# Altium schematic sheet RAMP V1-4交流電.SCHDOC
size 381 x 241 mm
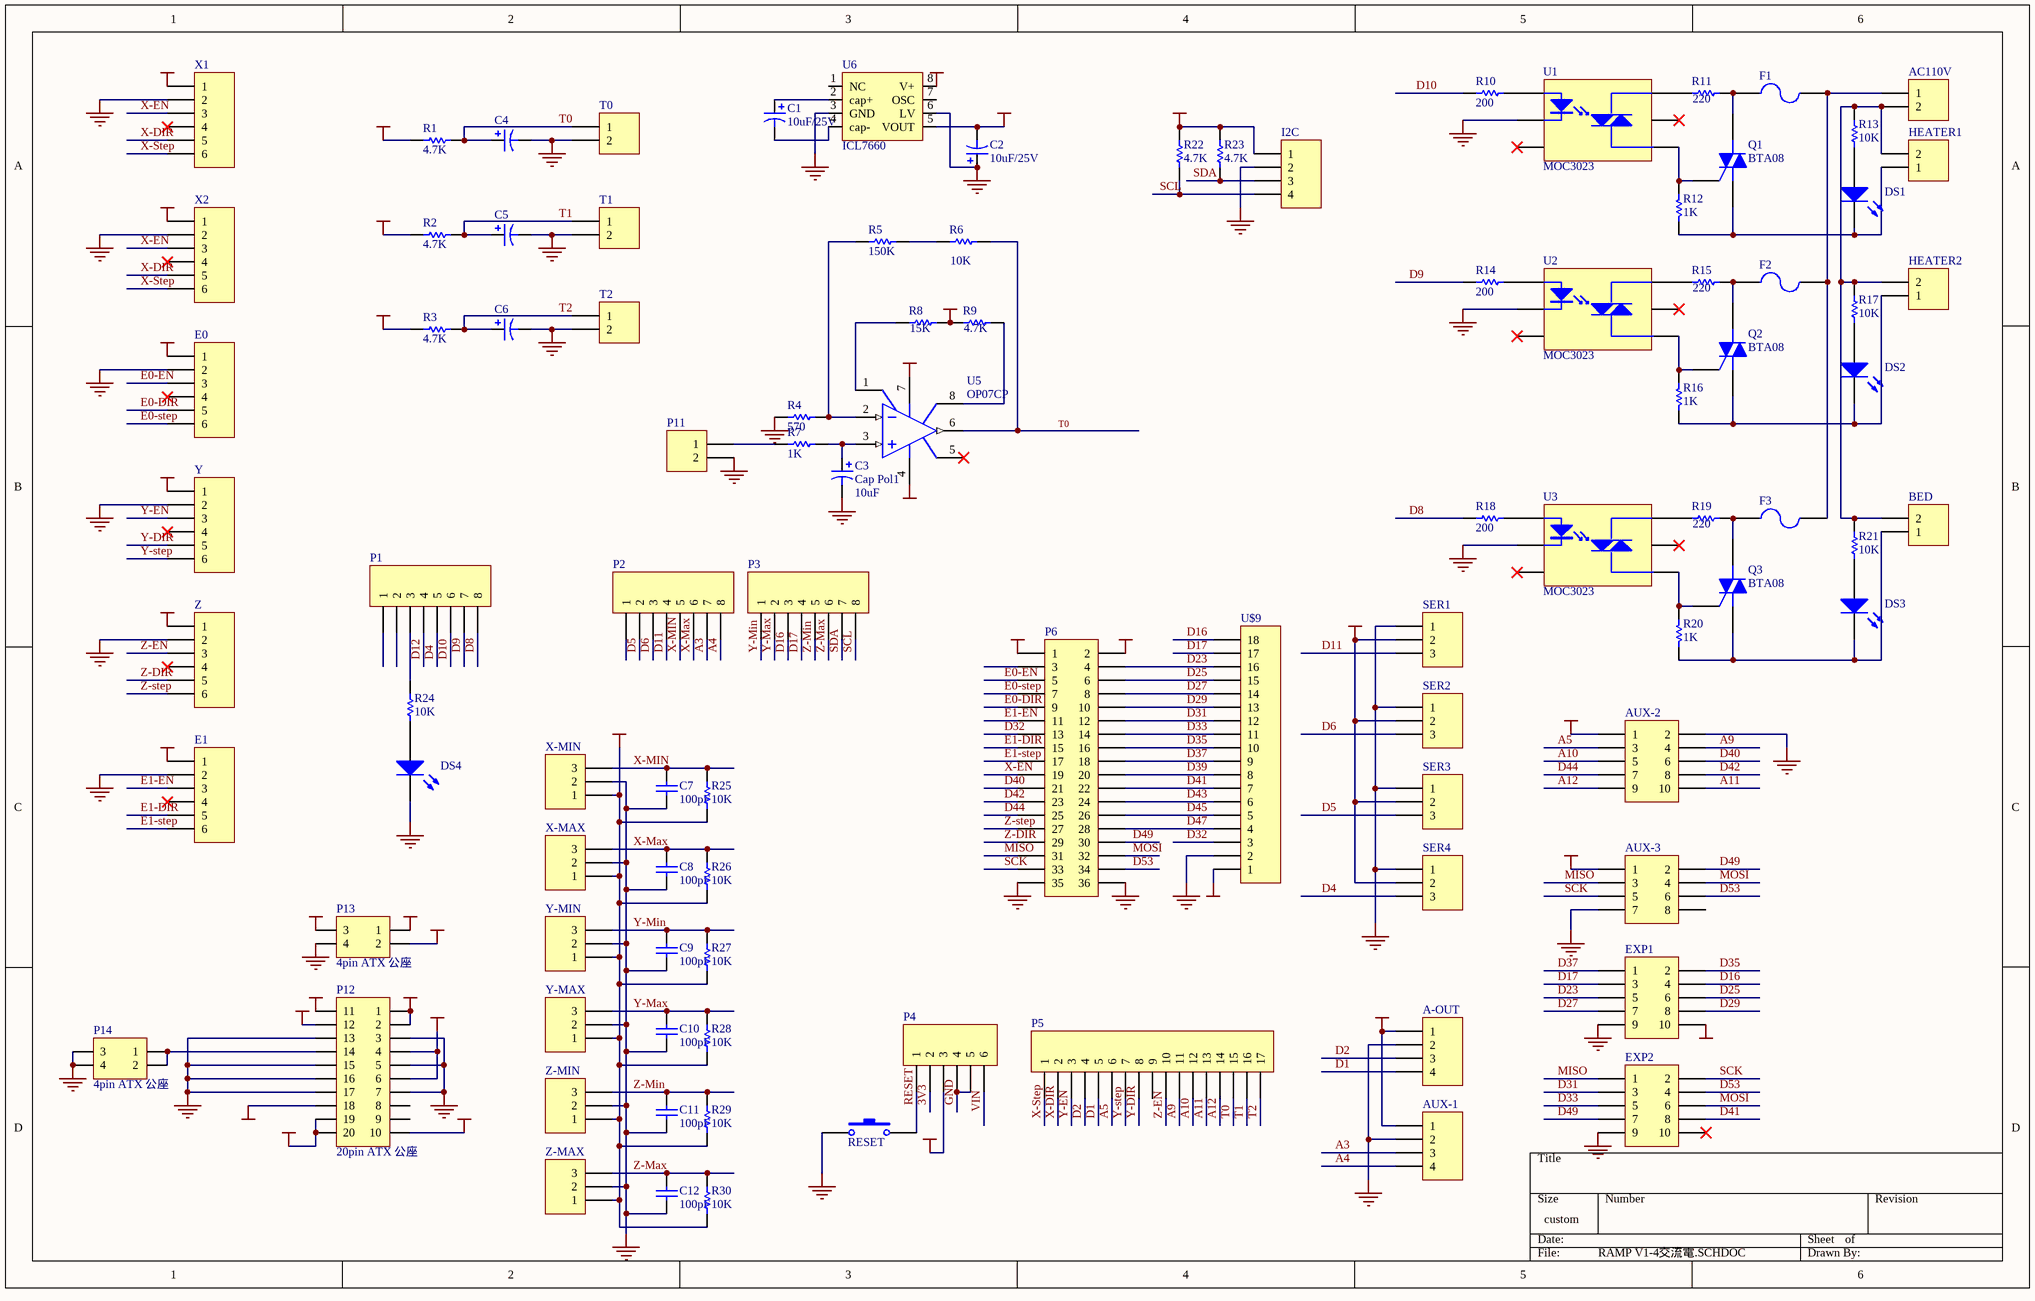
[diagram p0: RAMP V1-4交流電.SCHDOC]

## Parts
A-OUT  Header 4  [HDR1X4]  (value not drawn)
AC110V  Header 2  [2PIN端子-1]  (value not drawn)
AUX-1  Header 4  [HDR1X4]  (value not drawn)
AUX-2  Header 5X2  [HDR2X5]  (value not drawn)
AUX-3  Header 4X2  [HDR2X4]  (value not drawn)
BED  Header 2  [2PIN端子-1]  (value not drawn)
C1  value 10uF/25V  [CAPPR5-5x5]  (hidden comment: Cap Pol1)
C2  value 10uF/25V  [CAPPR5-5x5]  (hidden comment: Cap Pol1)
C3  Cap Pol1  value 10uF  [CAPPR5-5x5]
C4  Cap Pol1  [CAPPR2-5x6.8]  (value not drawn)
C5  Cap Pol1  [CAPPR2-5x6.8]  (value not drawn)
C6  Cap Pol1  [CAPPR2-5x6.8]  (value not drawn)
C7  value 100pF  [CAPR2.54-5.1x3.2]  (hidden comment: Cap)
C8  value 100pF  [CAPR2.54-5.1x3.2]  (hidden comment: Cap)
C9  value 100pF  [CAPR2.54-5.1x3.2]  (hidden comment: Cap)
C10  value 100pF  [CAPR2.54-5.1x3.2]  (hidden comment: Cap)
C11  value 100pF  [CAPR2.54-5.1x3.2]  (hidden comment: Cap)
C12  value 100pF  [CAPR2.54-5.1x3.2]  (hidden comment: Cap)
DS1  LED0  [LED-2]  (value not drawn)
DS2  LED0  [LED-2]  (value not drawn)
DS3  LED0  [LED-2]  (value not drawn)
DS4  LED0  [LED-2]  (value not drawn)
E0  Header 6  [2.54mm 6pin]  (value not drawn)
E1  Header 6  [2.54mm 6pin]  (value not drawn)
EXP1  Header 5X2  [10pin牛角公座]  (value not drawn)
EXP2  Header 5X2  [10pin牛角公座]  (value not drawn)
F1  Fuse 2  [保險絲座]  (value not drawn)
F2  Fuse 2  [保險絲座]  (value not drawn)
F3  Fuse 2  [保險絲座]  (value not drawn)
HEATER1  Header 2  [2PIN端子-1]  (value not drawn)
HEATER2  Header 2  [2PIN端子-1]  (value not drawn)
I2C  Header 4  [HDR1X4]  (value not drawn)
P1  Header 8  [HDR1X8]  (value not drawn)
P2  Header 8  [HDR1X8]  (value not drawn)
P3  Header 8  [HDR1X8]  (value not drawn)
P4  Header 6  [HDR1X6]  (value not drawn)
P5  Header 17  [HDR1X17]  (value not drawn)
P6  Header 18X2  [HDR2X18]  (value not drawn)
P11  Header 2  [2PIN端子¥x¦³¦Õ]  (value not drawn)
P12  20pin ATX 公座  [4.2mm 20pin]
P13  4pin ATX 公座  [4.2mm 4pin]
P14  4pin ATX 公座  [4.2mm 4pin]
Q1  BTA08  [SFM-T3/X1.6V]
Q2  BTA08  [SFM-T3/X1.6V]
Q3  BTA08  [SFM-T3/X1.6V]
R1  value 4.7K  [AXIAL-0.3]  (hidden comment: Res1)
R2  value 4.7K  [AXIAL-0.3]  (hidden comment: Res1)
R3  value 4.7K  [AXIAL-0.3]  (hidden comment: Res1)
R4  value 570  [AXIAL-0.3]  (hidden comment: Res1)
R5  value 150K  [AXIAL-0.3]  (hidden comment: Res1)
R6  value 10K  [AXIAL-0.3]  (hidden comment: Res1)
R7  value 1K  [AXIAL-0.3]  (hidden comment: Res1)
R8  value 15K  [AXIAL-0.3]  (hidden comment: Res1)
R9  value 4.7K  [AXIAL-0.3]  (hidden comment: Res1)
R10  value 200  [AXIAL-0.4]  (hidden comment: Res1)
R11  value 220  [AXIAL-0.7]  (hidden comment: Res1)
R12  value 1K  [AXIAL-0.6]  (hidden comment: Res1)
R13  value 10K  [AXIAL-0.3]  (hidden comment: Res1)
R14  value 200  [AXIAL-0.4]  (hidden comment: Res1)
R15  value 220  [AXIAL-0.7]  (hidden comment: Res1)
R16  value 1K  [AXIAL-0.6]  (hidden comment: Res1)
R17  value 10K  [AXIAL-0.3]  (hidden comment: Res1)
R18  value 200  [AXIAL-0.4]  (hidden comment: Res1)
R19  value 220  [AXIAL-0.7]  (hidden comment: Res1)
R20  value 1K  [AXIAL-0.6]  (hidden comment: Res1)
R21  value 10K  [AXIAL-0.3]  (hidden comment: Res1)
R22  value 4.7K  [AXIAL-0.3]  (hidden comment: Res1)
R23  value 4.7K  [AXIAL-0.3]  (hidden comment: Res1)
R24  value 10K  [AXIAL-0.3]  (hidden comment: Res1)
R25  value 10K  [AXIAL-0.3]  (hidden comment: Res1)
R26  value 10K  [AXIAL-0.3]  (hidden comment: Res1)
R27  value 10K  [AXIAL-0.3]  (hidden comment: Res1)
R28  value 10K  [AXIAL-0.3]  (hidden comment: Res1)
R29  value 10K  [AXIAL-0.3]  (hidden comment: Res1)
R30  value 10K  [AXIAL-0.3]  (hidden comment: Res1)
RESET  SW-PB  [SW DIP4-2]  (value not drawn)
SER1  Header 3  [HDR1X3]  (value not drawn)
SER2  Header 3  [HDR1X3]  (value not drawn)
SER3  Header 3  [HDR1X3]  (value not drawn)
SER4  Header 3  [HDR1X3]  (value not drawn)
T0  Header 2  [HDR1X2]  (value not drawn)
T1  Header 2  [HDR1X2]  (value not drawn)
T2  Header 2  [HDR1X2]  (value not drawn)
U1  MOC3023  [DIP-6]
U2  MOC3023  [DIP-6]
U3  MOC3023  [DIP-6]
U5  OP07CP  [DIP-8]
U6  ICL7660  [DIP-8]
U$9  Header 18  [HDR1X18]  (value not drawn)
X1  Header 6  [2.54mm 6pin]  (value not drawn)
X2  Header 6  [2.54mm 6pin]  (value not drawn)
X-MAX  Header 3  [2.54mm 3pin]  (value not drawn)
X-MIN  Header 3  [2.54mm 3pin]  (value not drawn)
Y  Header 6  [2.54mm 6pin]  (value not drawn)
Y-MAX  Header 3  [2.54mm 3pin]  (value not drawn)
Y-MIN  Header 3  [2.54mm 3pin]  (value not drawn)
Z  Header 6  [2.54mm 6pin]  (value not drawn)
Z-MAX  Header 3  [2.54mm 3pin]  (value not drawn)
Z-MIN  Header 3  [2.54mm 3pin]  (value not drawn)

## Nets
+3-3: P12.1 P12.2 P12.11 P13.2
+5: A-OUT.1 AUX-1.1 AUX-2.1 AUX-3.1 E0.1 E1.1 EXP1.10 I2C.1 P4.3 P6.1 P6.2 P12.4 P12.6 P12.19 P12.20 R1.1 R2.1 R3.1 R8.2 R9.1 R22.2 R23.2 R25.1 R26.1 R27.1 R28.1 R29.1 R30.1 SER1.2 SER2.2 SER3.2 SER4.2 U5.7(V+) U6.8(V+) U$9.1 X1.1 X2.1 X-MAX.1 X-MIN.1 Y.1 Y-MAX.1 Y-MIN.1 Z.1 Z-MAX.1 Z-MIN.1
+12: P12.10 P13.1
-5: C2.2 P12.18 U5.4(V-) U6.5(VOUT)
-12: P12.12
GND: A-OUT.2 AUX-1.2 AUX-2.2 AUX-3.7 C2.1 C3.2 C4.2 C5.2 C6.2 C7.1 C8.1 C9.1 C10.1 C11.1 C12.1 DS4.2(K) E0.2 E1.2 EXP1.9 EXP2.9 I2C.2 P4.4 P4.5 P6.35 P6.36 P11.2 P12.3 P12.5 P12.7 P12.13 P12.15 P12.16 P12.17 P13.4 P14.3 P14.4 R4.1 RESET.2 SER1.1 SER2.1 SER3.1 SER4.1 T0.2 T1.2 T2.2 U1.2(C) U2.2(C) U3.2(C) U6.3(GND) U6.6(LV) U$9.2 X1.2 X2.2 X-MAX.2 X-MIN.2 Y.2 Y-MAX.2 Y-MIN.2 Z.2 Z-MAX.2 Z-MIN.2
VCC: P13.3
3V3: P4.2
A3: AUX-1.3 P2.7
A4: AUX-1.4 P2.8
A5: AUX-2.3 P5.6
A9: AUX-2.4 P5.11
A10: AUX-2.5 P5.12
A11: AUX-2.10 P5.13
A12: AUX-2.9 P5.14
D1: A-OUT.4 P5.5
D2: A-OUT.3 P5.4
D4: P1.5 SER4.3
D5: P2.2 SER3.3
D6: P2.3 SER2.3
D8: P1.8 R18.1
D9: P1.7 R14.1
D10: P1.6 R10.1
D11: P2.4 SER1.3
D12: P1.4
D16: EXP1.4 P3.3 U$9.18
D17: EXP1.3 P3.4 U$9.17
D23: EXP1.5 P6.4 U$9.16
D25: EXP1.6 P6.6 U$9.15
D27: EXP1.7 P6.8 U$9.14
D29: EXP1.8 P6.10 U$9.13
D31: EXP2.3 P6.12 U$9.12
D32: P6.13 U$9.3
D33: EXP2.5 P6.14 U$9.11
D35: EXP1.2 P6.16 U$9.10
D37: EXP1.1 P6.18 U$9.9
D39: P6.20 U$9.8
D40: AUX-2.6 P6.21
D41: EXP2.8 P6.22 U$9.7
D42: AUX-2.8 P6.23
D43: P6.24 U$9.6
D44: AUX-2.7 P6.25
D45: P6.26 U$9.5
D47: P6.28 U$9.4
D49: AUX-3.2 EXP2.7 P6.30
D53: AUX-3.6 EXP2.4 P6.34
E0-DIR: E0.5 P6.9
E0-EN: E0.3 P6.5
E0-step: E0.6 P6.7
E1-DIR: E1.5 P6.15
E1-EN: E1.3 P6.11
E1-step: E1.6 P6.17
MISO: AUX-3.3 EXP2.1 P6.31
MOSI: AUX-3.4 EXP2.6 P6.32
RESET: P4.1 RESET.1
SCK: AUX-3.5 EXP2.2 P6.33
SCL: I2C.4 P3.8 R22.1
SDA: I2C.3 P3.7 R23.1
T0: C4.1 P5.15 R1.2 R6.2 T0.1 U5.6(OUT)
T1: C5.1 P5.16 R2.2 T1.1
T2: C6.1 P5.17 R3.2 T2.1
VIN: P4.6
X-DIR: P5.2 X1.5 X2.5
X-EN: P6.19 X1.3 X2.3
X-Max: C8.2 P2.6 R26.2 X-MAX.3
X-MIN: C7.2 P2.5 R25.2 X-MIN.3
X-Step: P5.1 X1.6 X2.6
Y-DIR: P5.8 Y.5
Y-EN: P5.3 Y.3
Y-Max: C10.2 P3.2 R28.2 Y-MAX.3
Y-Min: C9.2 P3.1 R27.2 Y-MIN.3
Y-step: P5.7 Y.6
Z-DIR: P6.29 Z.5
Z-EN: P5.10 Z.3
Z-Max: C12.2 P3.6 R30.2 Z-MAX.3
Z-Min: C11.2 P3.5 R29.2 Z-MIN.3
Z-step: P6.27 Z.6
NetAC110V_1: AC110V.1 F1.2 F2.2 F3.2
NetAC110V_2: AC110V.2 BED.2 HEATER1.2 HEATER2.2 R13.2 R17.2 R21.2
NetBED_1: BED.1 DS3.2(K) Q3.1(M1) R20.1
NetC1_1: C1.1 U6.2(cap+)
NetC1_2: C1.2 U6.4(cap-)
NetC3_1: C3.1 R7.2 U5.3(IN+)
NetDS1_1: DS1.1(A) R13.1
NetDS1_2: DS1.2(K) HEATER1.1 Q1.1(M1) R12.1
NetDS2_1: DS2.1(A) R17.1
NetDS2_2: DS2.2(K) HEATER2.1 Q2.1(M1) R16.1
NetDS3_1: DS3.1(A) R21.1
NetDS4_1: DS4.1(A) R24.1
NetF1_1: F1.1 Q1.2(M2) R11.2
NetF2_1: F2.1 Q2.2(M2) R15.2
NetF3_1: F3.1 Q3.2(M2) R19.2
NetP1_3: P1.3 R24.2
NetP11_1: P11.1 R7.1
NetP12_14: P12.14 P14.1 P14.2
NetQ1_3: Q1.3(G) R12.2 U1.4(main_terminal)
NetQ2_3: Q2.3(G) R16.2 U2.4(main_terminal)
NetQ3_3: Q3.3(G) R20.2 U3.4(main_terminal)
NetR4_2: R4.2 R5.1 U5.2(IN-)
NetR5_2: R5.2 R6.1
NetR8_1: R8.1 U5.1(VOSTRIM)
NetR9_2: R9.2 U5.8(VOSTRIM)
NetR10_2: R10.2 U1.1(A)
NetR11_1: R11.1 U1.6(main_terminal)
NetR14_2: R14.2 U2.1(A)
NetR15_1: R15.1 U2.6(main_terminal)
NetR18_2: R18.2 U3.1(A)
NetR19_1: R19.1 U3.6(main_terminal)

Not connected (* = marked no-connect by the designer): AUX-3 8; E0 4*; E1 4*; EXP2 10*; P1 1 2; P2 1; P5 9; P6 3; P12 8 9; U1 3(NC)* 5(NC)*; U2 3(NC)* 5(NC)*; U3 3(NC)* 5(NC)*; U5 5(NC)*; U6 1(NC) 7(OSC); X1 4*; X2 4*; Y 4*; Z 4*

## Library data of the parts
A-OUT AUX-1 I2C = Header 4: Header, 4-Pin; LatestRevisionDate: 17-Jul-2002; LatestRevisionNote: Re-released for DXP Platform.; Publisher: Altium Limited
AC110V BED HEATER1 HEATER2 P11 T0-T2 = Header 2: Header, 2-Pin; LatestRevisionDate: 17-Jul-2002; LatestRevisionNote: Re-released for DXP Platform.; Publisher: Altium Limited
AUX-2 EXP1 EXP2 = Header 5X2: Header, 5-Pin, Dual row; LatestRevisionDate: 17-Jul-2002; LatestRevisionNote: Re-released for DXP Platform.; Publisher: Altium Limited
AUX-3 = Header 4X2: Header, 4-Pin, Dual row; LatestRevisionDate: 17-Jul-2002; LatestRevisionNote: Re-released for DXP Platform.; Publisher: Altium Limited
C1-C6 = Cap Pol1: Polarized Capacitor (Radial); Published: 8-Jun-2000; LatestRevisionDate: 17-Jul-2002; LatestRevisionNote: Re-released for DXP Platform.; Publisher: Altium Limited
C7-C12 = Cap: Capacitor; Published: 8-Jun-2000; LatestRevisionDate: 17-Jul-2002; LatestRevisionNote: Re-released for DXP Platform.; Publisher: Altium Limited
DS1-DS4 = LED0: Typical INFRARED GaAs LED; Published: 8-Jun-2000; LatestRevisionDate: 17-Jul-2002; LatestRevisionNote: Re-released for DXP Platform.; Publisher: Altium Limited
E0 E1 P4 X1 X2 Y Z = Header 6: Header, 6-Pin; LatestRevisionDate: 17-Jul-2002; LatestRevisionNote: Re-released for DXP Platform.; Publisher: Altium Limited
F1-F3 = Fuse 2: Fuse; Published: 8-Jun-2000; LatestRevisionDate: 17-Jul-2002; LatestRevisionNote: Re-released for DXP Platform.; Publisher: Altium Limited
P1-P3 = Header 8: Header, 8-Pin; LatestRevisionDate: 17-Jul-2002; LatestRevisionNote: Re-released for DXP Platform.; Publisher: Altium Limited
P5 = Header 17: Header, 17-Pin; LatestRevisionDate: 17-Jul-2002; LatestRevisionNote: Re-released for DXP Platform.; Publisher: Altium Limited
P6 = Header 18X2: Header, 18-Pin, Dual row; LatestRevisionDate: 17-Jul-2002; LatestRevisionNote: Re-released for DXP Platform.; Publisher: Altium Limited
Q1-Q3 = Triac: Silicon Bidirectional Triode Thyristor; Note: Pin 2 is electrically connected to Pin 4 (TAB); Published: 29-Sep-2000; LatestRevisionDate: 17-Jul-2002; LatestRevisionNote: Re-released for DXP Platform.; DatasheetDocument: 1999; PackageReference: 221A-09; Publisher: Altium Limited; Code_JEDEC: TO-251-AA
R1-R30 = Res1: Resistor; Published: 8-Jun-2000; LatestRevisionDate: 17-Jul-2002; LatestRevisionNote: Re-released for DXP Platform.; Publisher: Altium Limited
RESET = SW-PB: Switch; Published: 24-Mar-1999; LatestRevisionDate: 17-Jul-2002; LatestRevisionNote: Re-released for DXP Platform.; Publisher: Altium Limited
SER1-SER4 X-MAX X-MIN Y-MAX Y-MIN Z-MAX Z-MIN = Header 3: Header, 3-Pin; LatestRevisionDate: 17-Jul-2002; LatestRevisionNote: Re-released for DXP Platform.; Publisher: Altium Limited
U5 = OP07CP: Ultra-Low Offset Voltage Operational Amplifier; Note: Pin 5 is not connected.; Published: 8-Jun-2000; LatestRevisionDate: 17-Jul-2002; LatestRevisionNote: Re-released for DXP Platform.; DatasheetDocument: 1992; PackageReference: N-8_A; Publisher: Altium Limited; Code_JEDEC: MO-001-AN
U$9 = Header 18: Header, 18-Pin; LatestRevisionDate: 17-Jul-2002; LatestRevisionNote: Re-released for DXP Platform.; Publisher: Altium Limited